# Altium schematic sheet TEMPS_280.SchDoc
size 300 x 200 mm; Revision: 1 version
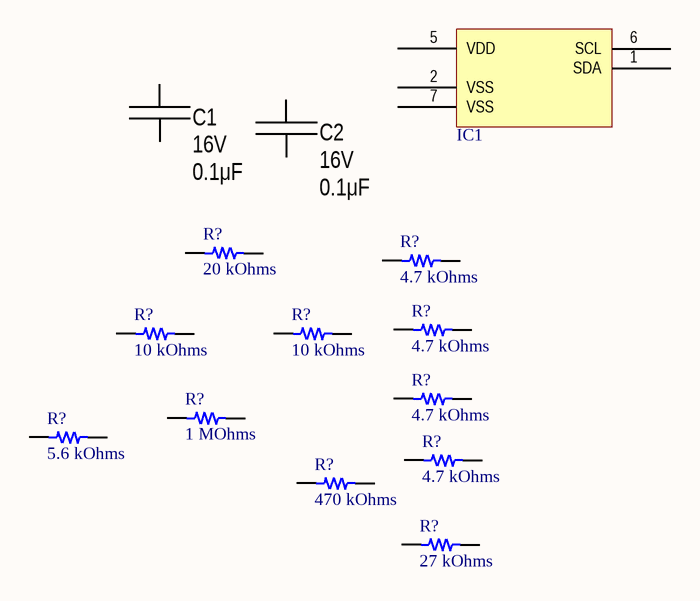
[diagram p0: TEMPS_280.SchDoc]

## Parts
(Parts that share a designator on the sheet are numbered #1, #2 ... from top to bottom, then left to right.)
C1  value 0.1μF  Voltage: 16V  [CAP: 0805]
C2  value 0.1μF  Voltage: 16V  [CAP: 0805]
IC1  STS21  [SENSIRION STS21]  (value not drawn)
R?#1  20 kOhms  [RES 0805_2012]
R?#2  4.7 kOhms  [RES 0805_2012]
R?#3  10 kOhms  [RES 0805_2012]
R?#4  10 kOhms  [RES 0805_2012]
R?#5  4.7 kOhms  [RES 0805_2012]
R?#6  4.7 kOhms  [RES 0805_2012]
R?#7  1 MOhms  [RES 0805_2012]
R?#8  5.6 kOhms  [RES 0805_2012]
R?#9  4.7 kOhms  [RES 0805_2012]
R?#10  470 kOhms  [RES 0805_2012]
R?#11  27 kOhms  [RES 0805_2012]

## Nets

Not connected (* = marked no-connect by the designer): C1 1 2; C2 1 2; IC1 1(SDA) 2(VSS) 5(VDD) 6(SCL) 7(VSS); R?#1 1 2; R?#2 1 2; R?#3 1 2; R?#4 1 2; R?#5 1 2; R?#6 1 2; R?#7 1 2; R?#8 1 2; R?#9 1 2; R?#10 1 2; R?#11 1 2

## Library data of the parts
C1 C2 = Ceramic_0805: Manufacturer: Yageo; PartNumber: CC0805KRX7R7BB104; ValueManufacturerPartNumber: Ceramic capacitor, 0.1μF, X7R, ±10%, 16V, 0805, -55...+125°C; TypeCapacitor: Ceramic capacitor; Tolerance: ±10%; TypeDielectric: X7R; Package: 0805; HelpURL: https://www.digikey.com/product-detail/en/yageo/CC0805KRX7R7BB104/311-1142-1-ND/303052; Temperature: -55...+125°C
IC1 = STS21: SENSOR DIGITAL -40C-125C 6DFN; Manufacturer: Sensirion AG; Accuracy - Highest (Lowest): ±0.2°C; Output Type: I²C; Resolution: 14 b; Sensing Temperature - Local: -40°C ~ 125°C; Sensor Type: Digital, Local; Test Condition: 25°C; Voltage - Supply: 2.1V ~ 3.6V; ComponentLink1Description: Datasheet; ComponentLink1URL: https://www.sensirion.com/file/datasheet_sts21; ComponentLink2Description: DigiKey Link; ComponentLink2URL: http://digikey.com/product-detail/en/sensirion-ag/STS21/1649-1016-1-ND/5872298; Device Package: 6-TDFN Exposed Pad; Features: Sleep Mode; LastUpdated: 20/04/2020 15.29.15; Lifecycle Status: Active; Part Number: STS21; Minimum Order: 1; Mounting Type: Surface Mount; Operating Temperature: -40°C ~ 125°C; Package / Case: 6-TDFN Exposed Pad; Packaging: TapeAndReel; Part Status: Active; Price: 1.70; Series: Automotive, AEC-Q100; Supplier 1: DigiKey; Supplier Part Number 1: 1649-1016-1-ND; Supplier Device Package: 6-DFN (3x3)
R?#1 = RNCF0805TKT20K0: RES 20K OHM 0.01% 1/8W 0805; Manufacturer: Stackpole Electronics Inc; Power (Watts): 0.125W, 1/8W; Temperature Coefficient: ±10ppm/°C; Part Number: RNCF0805TKT20K0; Value: 20 kOhms; ComponentLink1Description: Datasheet; ComponentLink1URL: https://www.seielect.com/catalog/sei-rncf.pdf; ComponentLink2Description: DigiKey Link; ComponentLink2URL: http://digikey.com/product-detail/en/stackpole-electronics-inc/RNCF0805TKT20K0/RNCF0805TKT20K0CT-ND/2687088; Composition: Thin Film; Device Package: 0805 (2012 Metric); Features: Automotive AEC-Q200; Height - Seated (Max): 0.026" (0.65mm); LastUpdated: 21/01/2020 1.43.57; Lifecycle Status: Active; Minimum Order: 1; Number of Terminations: 2; Operating Temperature: -55°C ~ 155°C; Package / Case: 0805 (2012 Metric); Packaging: TapeAndReel; PartId: 41681; Part Status: Active; Price: 0.56; Ratings: AEC-Q200; Resistance: 20 kOhms; Series: RNCF; Size / Dimension: 0.079" L x 0.049" W (2.00mm x 1.25mm); Supplier 1: DigiKey; Supplier Part Number 1: RNCF0805TKT20K0CT-ND; Supplier Device Package: 0805; Tolerance: ±0.01%
R?#2 R?#5 R?#6 R?#9 = RCS08054K70JNEA: RES SMD 4.7K OHM 5% 0.4W 0805; Manufacturer: Vishay Dale; Power (Watts): 0.4W, 2/5W; Temperature Coefficient: ±200ppm/°C; Part Number: RCS08054K70JNEA; Value: 4.7 kOhms; ComponentLink1Description: Datasheet; ComponentLink1URL: http://www.vishay.com/docs/20065/rcse3.pdf; ComponentLink2Description: DigiKey Link; ComponentLink2URL: http://digikey.com/product-detail/en/vishay-dale/RCS08054K70JNEA/541-2866-1-ND/5867159; Composition: Thick Film; Device Package: 0805 (2012 Metric); Features: Automotive AEC-Q200, Pulse Withstanding; Height - Seated (Max): 0.020" (0.50mm); LastUpdated: 21/01/2020 1.50.02; Lifecycle Status: Active; Minimum Order: 1; Number of Terminations: 2; Operating Temperature: -55°C ~ 155°C; Package / Case: 0805 (2012 Metric); Packaging: TapeAndReel; PartId: 27839; Part Status: Active; Price: 0.02; Ratings: AEC-Q200; Resistance: 4.7 kOhms; Series: AccliMate™ RCU; Size / Dimension: 0.079" L x 0.049" W (2.00mm x 1.25mm); Supplier 1: DigiKey; Supplier Part Number 1: 541-2866-1-ND; Supplier Device Package: 0805; Tolerance: ±5%
R?#3 R?#4 = RNCS0805BKE10K0: RES 10K OHM 0.1% 1/10W 0805; Manufacturer: Stackpole Electronics Inc; Power (Watts): 0.1W, 1/10W; Temperature Coefficient: ±25ppm/°C; Part Number: RNCS0805BKE10K0; Value: 10 kOhms; ComponentLink1Description: Datasheet; ComponentLink1URL: https://www.seielect.com/catalog/sei-rncs_rnch.pdf; ComponentLink2Description: DigiKey Link; ComponentLink2URL: http://digikey.com/product-detail/en/stackpole-electronics-inc/RNCS0805BKE10K0/RNCS0805BKE10K0CT-ND/1800164; Composition: Thin Film; Device Package: 0805 (2012 Metric); Features: Anti-Corrosive, Automotive AEC-Q200, Moisture Resistant; Height - Seated (Max): 0.026" (0.65mm); LastUpdated: 21/01/2020 1.50.08; Lifecycle Status: Active; Minimum Order: 1; Number of Terminations: 2; Operating Temperature: -55°C ~ 155°C; Package / Case: 0805 (2012 Metric); Packaging: TapeAndReel; PartId: 27713; Part Status: Active; Price: 0.09; Ratings: AEC-Q200; Resistance: 10 kOhms; Series: RNCS; Size / Dimension: 0.079" L x 0.049" W (2.00mm x 1.25mm); Supplier 1: DigiKey; Supplier Part Number 1: RNCS0805BKE10K0CT-ND; Supplier Device Package: 0805; Tolerance: ±0.1%
R?#7 = RCS08051M00FKEA: RES SMD 1M OHM 1% 0.4W 0805; Manufacturer: Vishay Dale; Power (Watts): 0.4W, 2/5W; Temperature Coefficient: ±100ppm/°C; Part Number: RCS08051M00FKEA; Value: 1 MOhms; ComponentLink1Description: Datasheet; ComponentLink1URL: http://www.vishay.com/docs/20065/rcse3.pdf; ComponentLink2Description: DigiKey Link; ComponentLink2URL: http://digikey.com/product-detail/en/vishay-dale/RCS08051M00FKEA/541-2853-1-ND/5867146; Composition: Thick Film; Device Package: 0805 (2012 Metric); Features: Automotive AEC-Q200, Pulse Withstanding; Height - Seated (Max): 0.020" (0.50mm); LastUpdated: 21/01/2020 1.50.02; Lifecycle Status: Active; Minimum Order: 1; Number of Terminations: 2; Operating Temperature: -55°C ~ 155°C; Package / Case: 0805 (2012 Metric); Packaging: TapeAndReel; PartId: 27791; Part Status: Active; Price: 0.03; Ratings: AEC-Q200; Resistance: 1 MOhms; Series: AccliMate™ RCU; Size / Dimension: 0.079" L x 0.049" W (2.00mm x 1.25mm); Supplier 1: DigiKey; Supplier Part Number 1: 541-2853-1-ND; Supplier Device Package: 0805; Tolerance: ±1%
R?#8 = ERA-6ARW562V: RES 5.6K OHM 0.05% 1/8W 0805; Manufacturer: Panasonic Electronic Components; Power (Watts): 0.125W, 1/8W; Temperature Coefficient: ±10ppm/°C; Part Number: ERA-6ARW562V; Value: 5.6 kOhms; ComponentLink1Description: Datasheet; ComponentLink1URL: https://industrial.panasonic.com/cdbs/www-data/pdf/RDM0000/AOA0000C307.pdf; ComponentLink2Description: DigiKey Link; ComponentLink2URL: http://digikey.com/product-detail/en/panasonic-electronic-components/ERA-6ARW562V/P5.6KBSCT-ND/3073427; Composition: Thin Film; Device Package: 0805 (2012 Metric); Features: Automotive AEC-Q200; Height - Seated (Max): 0.024" (0.60mm); LastUpdated: 21/01/2020 1.45.54; Lifecycle Status: Active; Minimum Order: 1; Number of Terminations: 2; Operating Temperature: -55°C ~ 155°C; Package / Case: 0805 (2012 Metric); Packaging: TapeAndReel; PartId: 37268; Part Status: Active; Price: 0.24; Ratings: AEC-Q200; Resistance: 5.6 kOhms; Series: ERA-6A; Size / Dimension: 0.079" L x 0.049" W (2.00mm x 1.25mm); Supplier 1: DigiKey; Supplier Part Number 1: P5.6KBSCT-ND; Supplier Device Package: 0805; Tolerance: ±0.05%
R?#10 = CRGP0805F470K: CRGP 0805 470K 1%; Manufacturer: TE Connectivity Passive Product; Power (Watts): 0.333W, 1/3W; Temperature Coefficient: ±100ppm/°C; Part Number: CRGP0805F470K; Value: 470 kOhms; ComponentLink1Description: Datasheet; ComponentLink1URL: https://www.te.com/commerce/DocumentDelivery/DDEController?Action=srchrtrv&DocNm=9-1773463-9&DocType=DS&DocLang=English; ComponentLink2Description: DigiKey Link; ComponentLink2URL: http://digikey.com/product-detail/en/te-connectivity-passive-product/CRGP0805F470K/A130509CT-ND/8578341; Composition: Thick Film; Device Package: 0805 (2012 Metric); Features: Pulse Withstanding; Height - Seated (Max): 0.026" (0.65mm); LastUpdated: 21/01/2020 1.49.38; Lifecycle Status: Active; Minimum Order: 1; Number of Terminations: 2; Operating Temperature: -55°C ~ 155°C; Package / Case: 0805 (2012 Metric); Packaging: TapeAndReel; PartId: 28755; Part Status: Active; Price: 0.02; Resistance: 470 kOhms; Series: CRGP; Size / Dimension: 0.079" L x 0.049" W (2.00mm x 1.25mm); Supplier 1: DigiKey; Supplier Part Number 1: A130509CT-ND; Supplier Device Package: 0805; Tolerance: ±1%
R?#11 = CRGP0805F27K: CRGP 0805 27K 1%; Manufacturer: TE Connectivity Passive Product; Power (Watts): 0.333W, 1/3W; Temperature Coefficient: ±100ppm/°C; Part Number: CRGP0805F27K; Value: 27 kOhms; ComponentLink1Description: Datasheet; ComponentLink1URL: https://www.te.com/commerce/DocumentDelivery/DDEController?Action=srchrtrv&DocNm=9-1773463-9&DocType=DS&DocLang=English; ComponentLink2Description: DigiKey Link; ComponentLink2URL: http://digikey.com/product-detail/en/te-connectivity-passive-product/CRGP0805F27K/A130494CT-ND/8578326; Composition: Thick Film; Device Package: 0805 (2012 Metric); Features: Pulse Withstanding; Height - Seated (Max): 0.026" (0.65mm); LastUpdated: 21/01/2020 1.49.38; Lifecycle Status: Active; Minimum Order: 1; Number of Terminations: 2; Operating Temperature: -55°C ~ 155°C; Package / Case: 0805 (2012 Metric); Packaging: TapeAndReel; PartId: 28735; Part Status: Active; Price: 0.02; Resistance: 27 kOhms; Series: CRGP; Size / Dimension: 0.079" L x 0.049" W (2.00mm x 1.25mm); Supplier 1: DigiKey; Supplier Part Number 1: A130494CT-ND; Supplier Device Package: 0805; Tolerance: ±1%